# Altium schematic sheet Lattice_ECP5.SchDoc: <title>
size C; Organization: Custom Embedded Solutions, LLC.; Address1: 130 Oakland Trace; Address2: Madison, AL 35758; DocumentNumber: <doc_num>; Revision: <Rev>; SheetNumber: 2; SheetTotal: 8; PageTitle: FPGA I/O
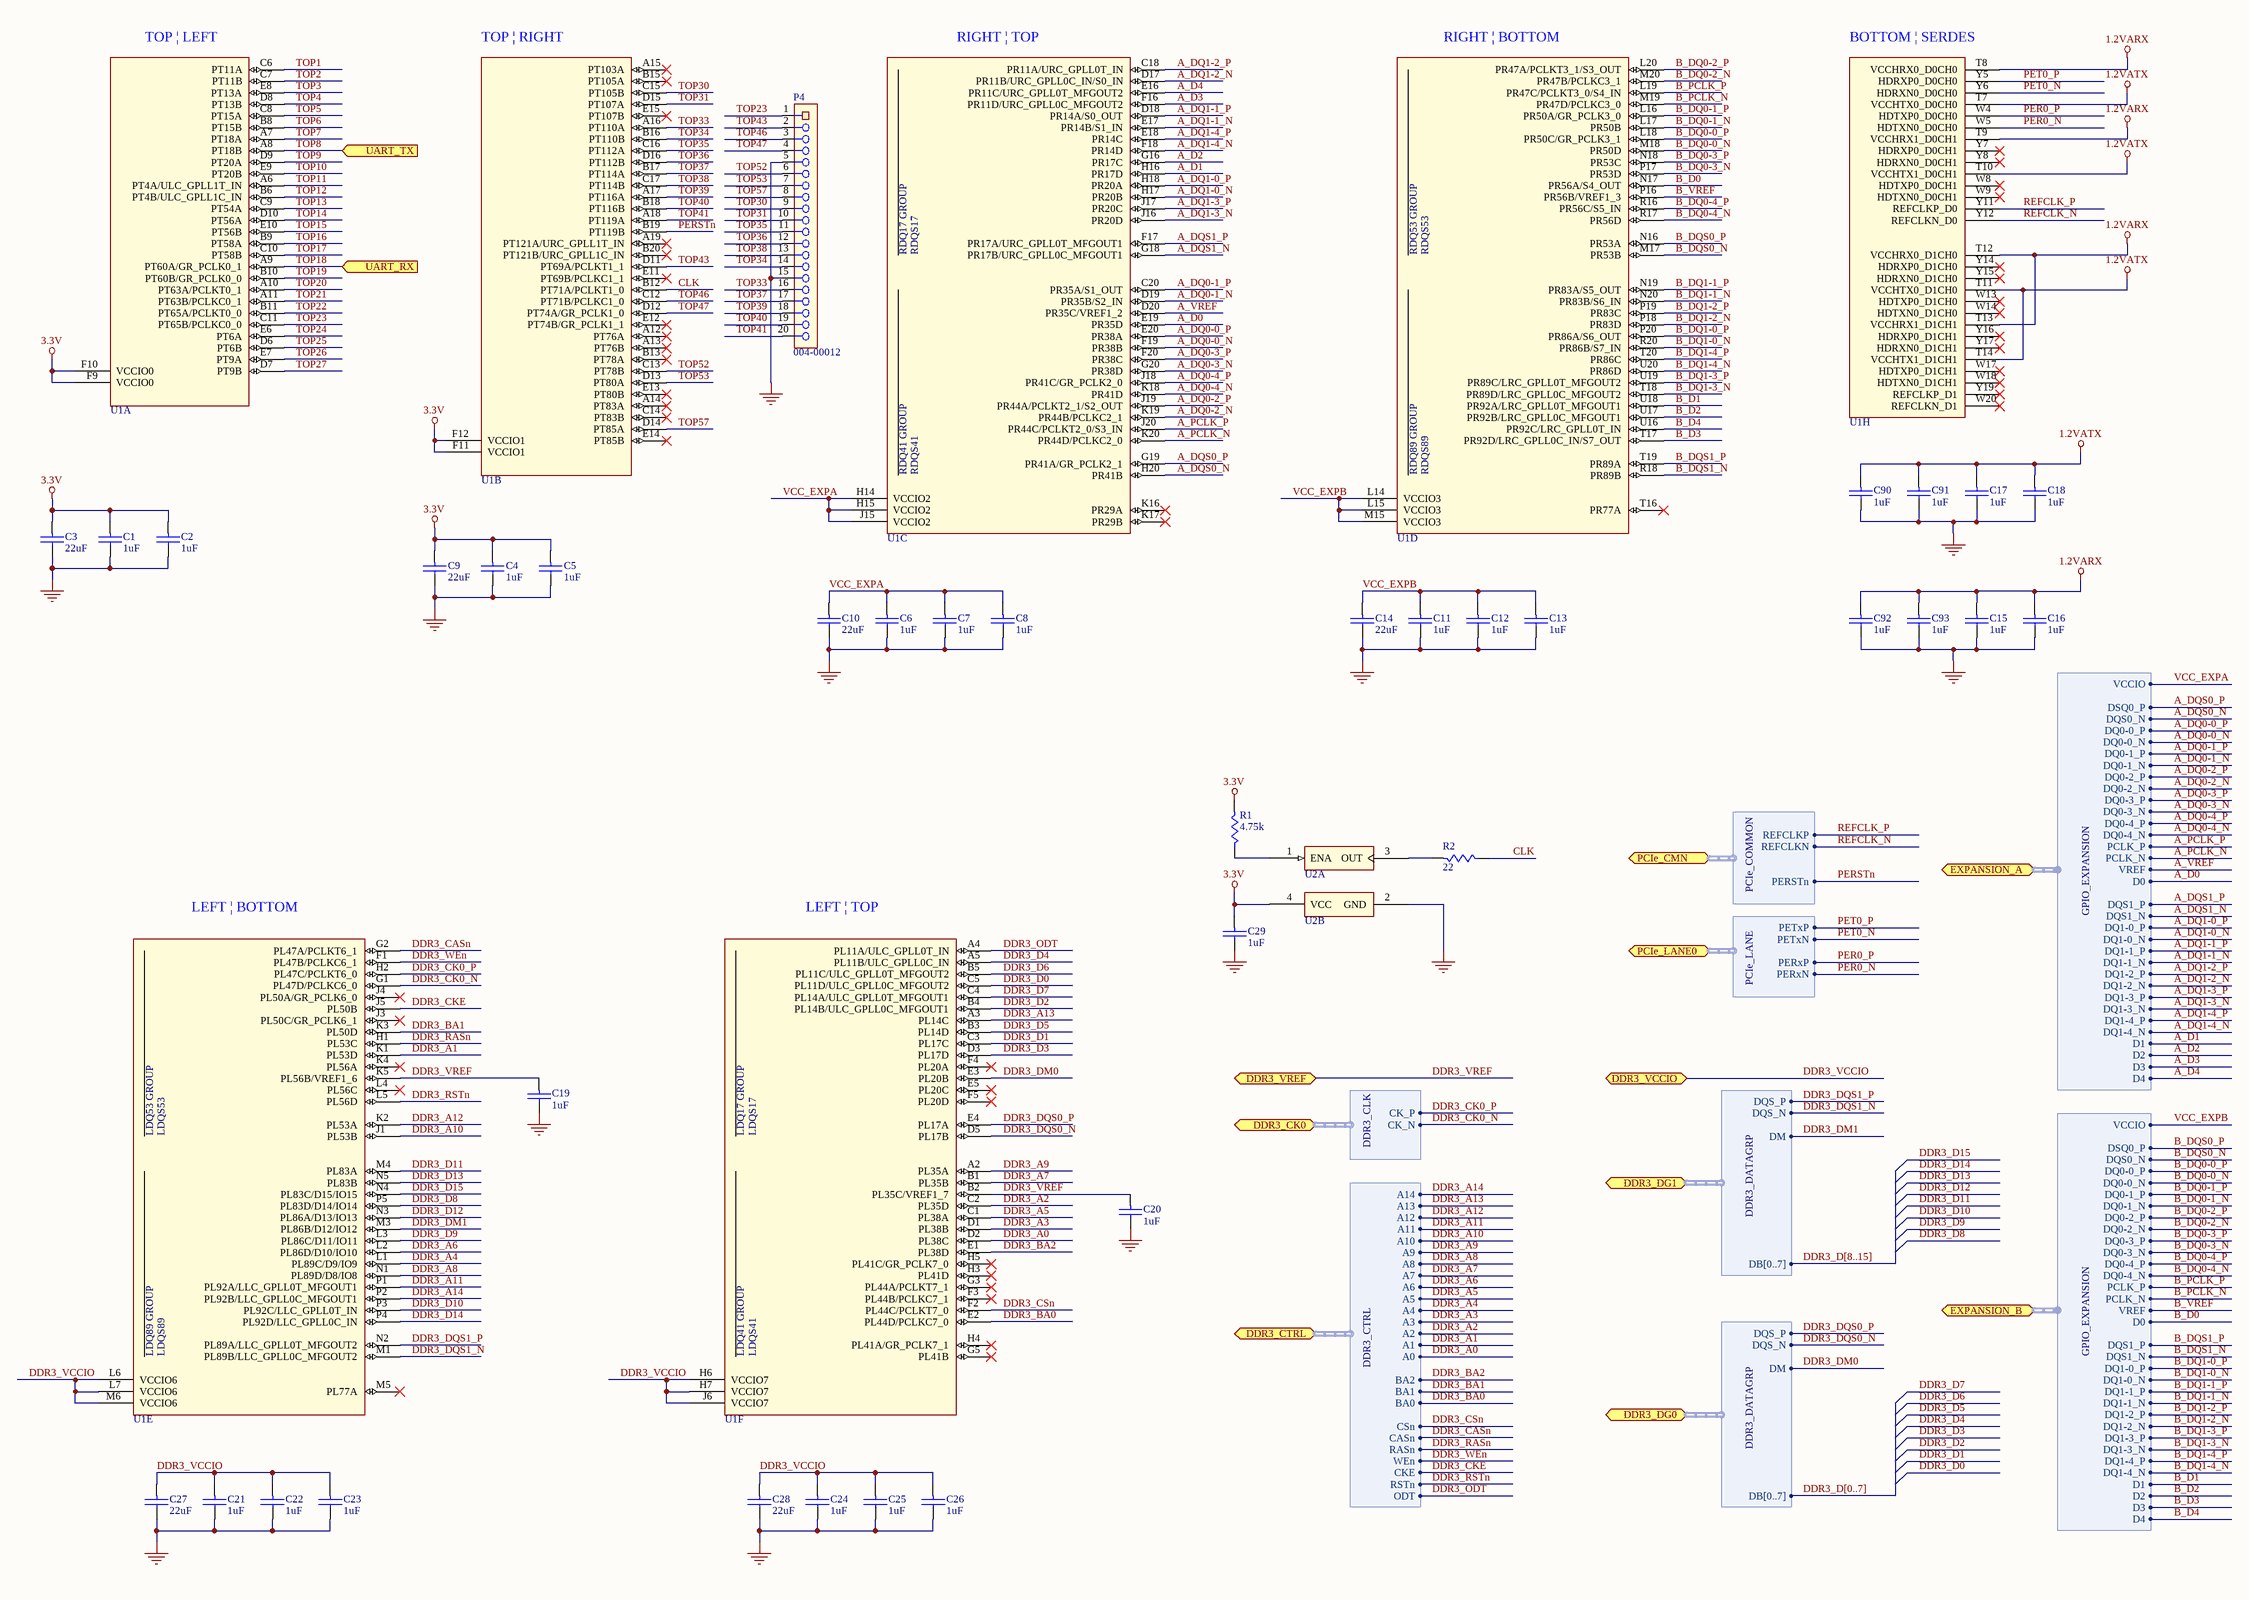
[diagram p0: Lattice_ECP5.SchDoc]

## Parts
C1  1uF  [005-00008]
C2  1uF  [005-00008]
C3  22uF  [005-00003]
C4  1uF  [005-00008]
C5  1uF  [005-00008]
C6  1uF  [005-00008]
C7  1uF  [005-00008]
C8  1uF  [005-00008]
C9  22uF  [005-00003]
C10  22uF  [005-00003]
C11  1uF  [005-00008]
C12  1uF  [005-00008]
C13  1uF  [005-00008]
C14  22uF  [005-00003]
C15  1uF  [005-00008]
C16  1uF  [005-00008]
C17  1uF  [005-00008]
C18  1uF  [005-00008]
C19  1uF  [005-00008]
C20  1uF  [005-00008]
C21  1uF  [005-00008]
C22  1uF  [005-00008]
C23  1uF  [005-00008]
C24  1uF  [005-00008]
C25  1uF  [005-00008]
C26  1uF  [005-00008]
C27  22uF  [005-00003]
C28  22uF  [005-00003]
C29  1uF  [005-00008]
C90  1uF  [005-00008]
C91  1uF  [005-00008]
C92  1uF  [005-00008]
C93  1uF  [005-00008]
P4  004-00012  [005-00014]
R1  4.75k  [005-00009]
R2  22  [005-00009]
U1  004-00015  [005-00017]  (value not drawn)  (parts A,B,C,D,E,F,H of 10)
U2  004-00014  [005-00016]  (value not drawn)  (parts A,B of 2)

## Ports
DDR3_CK0 (harness DDR3_CLK), DDR3_CTRL (harness DDR3_CTRL), DDR3_DG0 (harness DDR3_DATAGRP), DDR3_DG1 (harness DDR3_DATAGRP), DDR3_VCCIO, DDR3_VREF, EXPANSION_A (harness GPIO_EXPANSION), EXPANSION_B (harness GPIO_EXPANSION), PCIe_CMN (harness PCIe_COMMON), PCIe_LANE0 (harness PCIe_LANE), UART_RX (in), UART_TX (in)

## Harnesses
PCIe_COMMON: PERSTn, REFCLKP, REFCLKN
PCIe_LANE: PETxP, PETxN, PERxP, PERxN
GPIO_EXPANSION: DSQ0_P, DQS0_N, DQ0-0_P, DQ0-0_N, DQ0-1_P, DQ0-1_N, DQ0-2_P, DQ0-2_N, DQ0-3_P, DQ0-3_N, DQ0-4_P, DQ0-4_N, PCLK_P, PCLK_N, VREF, D0, DQS1_P, DQS1_N, DQ1-0_P, DQ1-0_N, DQ1-1_P, DQ1-1_N, DQ1-2_P, DQ1-2_N, DQ1-3_P, DQ1-3_N, DQ1-4_P, DQ1-4_N, D1, D2, D3, D4, VCCIO
DDR3_CLK: CK_P, CK_N
DDR3_CTRL: A14, A13, A12, A11, A10, A9, A8, A7, A6, A5, A4, A3, A2, A1, A0, BA2, BA1, BA0, CSn, RASn, CASn, WEn, CKE, RSTn, ODT
DDR3_DATAGRP: DQS_P, DQS_N, DM, DB[0..7]

## Nets
1.2VARX: C15.1 C16.1 C92.1 C93.1 U1.T8(VCCHRX0_D0CH0) U1.T9(VCCHRX1_D0CH1) U1.T12(VCCHRX0_D1CH0) U1.T13(VCCHRX1_D1CH1)
1.2VATX: C17.1 C18.1 C90.1 C91.1 U1.T7(VCCHTX0_D0CH0) U1.T10(VCCHTX1_D0CH1) U1.T11(VCCHTX0_D1CH0) U1.T14(VCCHTX1_D1CH1)
3.3V: C1.1 C2.1 C3.1 C4.1 C5.1 C9.1 C29.1 R1.1 U1.F9(VCCIO0) U1.F10(VCCIO0) U1.F11(VCCIO1) U1.F12(VCCIO1) U2.4(VCC)
GND: C1.2 C2.2 C3.2 C4.2 C5.2 C6.2 C7.2 C8.2 C9.2 C10.2 C11.2 C12.2 C13.2 C14.2 C15.2 C16.2 C17.2 C18.2 C19.2 C20.2 C21.2 C22.2 C23.2 C24.2 C25.2 C26.2 C27.2 C28.2 C29.2 C90.2 C91.2 C92.2 C93.2 P4.5 P4.15 U2.2(GND)
A_D0: U1.E19(PR35D) ; port EXPANSION_A.D0
A_D1: U1.H16(PR17D) ; port EXPANSION_A.D1
A_D2: U1.G16(PR17C) ; port EXPANSION_A.D2
A_D3: U1.F16(PR11D/URC_GPLL0C_MFGOUT2) ; port EXPANSION_A.D3
A_D4: U1.E16(PR11C/URC_GPLL0T_MFGOUT2) ; port EXPANSION_A.D4
A_DQ0-0_N: U1.F19(PR38B) ; port EXPANSION_A.DQ0-0_N
A_DQ0-0_P: U1.E20(PR38A) ; port EXPANSION_A.DQ0-0_P
A_DQ0-1_N: U1.D19(PR35B/S2_IN) ; port EXPANSION_A.DQ0-1_N
A_DQ0-1_P: U1.C20(PR35A/S1_OUT) ; port EXPANSION_A.DQ0-1_P
A_DQ0-2_N: U1.K19(PR44B/PCLKC2_1) ; port EXPANSION_A.DQ0-2_N
A_DQ0-2_P: U1.J19(PR44A/PCLKT2_1/S2_OUT) ; port EXPANSION_A.DQ0-2_P
A_DQ0-3_N: U1.G20(PR38D) ; port EXPANSION_A.DQ0-3_N
A_DQ0-3_P: U1.F20(PR38C) ; port EXPANSION_A.DQ0-3_P
A_DQ0-4_N: U1.K18(PR41D) ; port EXPANSION_A.DQ0-4_N
A_DQ0-4_P: U1.J18(PR41C/GR_PCLK2_0) ; port EXPANSION_A.DQ0-4_P
A_DQ1-0_N: U1.H17(PR20B) ; port EXPANSION_A.DQ1-0_N
A_DQ1-0_P: U1.H18(PR20A) ; port EXPANSION_A.DQ1-0_P
A_DQ1-1_N: U1.E17(PR14B/S1_IN) ; port EXPANSION_A.DQ1-1_N
A_DQ1-1_P: U1.D18(PR14A/S0_OUT) ; port EXPANSION_A.DQ1-1_P
A_DQ1-2_N: U1.D17(PR11B/URC_GPLL0C_IN/S0_IN) ; port EXPANSION_A.DQ1-2_N
A_DQ1-2_P: U1.C18(PR11A/URC_GPLL0T_IN) ; port EXPANSION_A.DQ1-2_P
A_DQ1-3_N: U1.J16(PR20D) ; port EXPANSION_A.DQ1-3_N
A_DQ1-3_P: U1.J17(PR20C) ; port EXPANSION_A.DQ1-3_P
A_DQ1-4_N: U1.F18(PR14D) ; port EXPANSION_A.DQ1-4_N
A_DQ1-4_P: U1.E18(PR14C) ; port EXPANSION_A.DQ1-4_P
A_DQS0_N: U1.H20(PR41B) ; port EXPANSION_A.DQS0_N
A_DQS0_P: U1.G19(PR41A/GR_PCLK2_1) ; port EXPANSION_A.DSQ0_P
A_DQS1_N: U1.G18(PR17B/URC_GPLL0C_MFGOUT1) ; port EXPANSION_A.DQS1_N
A_DQS1_P: U1.F17(PR17A/URC_GPLL0T_MFGOUT1) ; port EXPANSION_A.DQS1_P
A_PCLK_N: U1.K20(PR44D/PCLKC2_0) ; port EXPANSION_A.PCLK_N
A_PCLK_P: U1.J20(PR44C/PCLKT2_0/S3_IN) ; port EXPANSION_A.PCLK_P
A_VREF: U1.D20(PR35C/VREF1_2) ; port EXPANSION_A.VREF
B_D0: U1.N17(PR56A/S4_OUT) ; port EXPANSION_B.D0
B_D1: U1.U18(PR92A/LRC_GPLL0T_MFGOUT1) ; port EXPANSION_B.D1
B_D2: U1.U17(PR92B/LRC_GPLL0C_MFGOUT1) ; port EXPANSION_B.D2
B_D3: U1.T17(PR92D/LRC_GPLL0C_IN/S7_OUT) ; port EXPANSION_B.D3
B_D4: U1.U16(PR92C/LRC_GPLL0T_IN) ; port EXPANSION_B.D4
B_DQ0-0_N: U1.M18(PR50D) ; port EXPANSION_B.DQ0-0_N
B_DQ0-0_P: U1.L18(PR50C/GR_PCLK3_1) ; port EXPANSION_B.DQ0-0_P
B_DQ0-1_N: U1.L17(PR50B) ; port EXPANSION_B.DQ0-1_N
B_DQ0-1_P: U1.L16(PR50A/GR_PCLK3_0) ; port EXPANSION_B.DQ0-1_P
B_DQ0-2_N: U1.M20(PR47B/PCLKC3_1) ; port EXPANSION_B.DQ0-2_N
B_DQ0-2_P: U1.L20(PR47A/PCLKT3_1/S3_OUT) ; port EXPANSION_B.DQ0-2_P
B_DQ0-3_N: U1.P17(PR53D) ; port EXPANSION_B.DQ0-3_N
B_DQ0-3_P: U1.N18(PR53C) ; port EXPANSION_B.DQ0-3_P
B_DQ0-4_N: U1.R17(PR56D) ; port EXPANSION_B.DQ0-4_N
B_DQ0-4_P: U1.R16(PR56C/S5_IN) ; port EXPANSION_B.DQ0-4_P
B_DQ1-0_N: U1.R20(PR86B/S7_IN) ; port EXPANSION_B.DQ1-0_N
B_DQ1-0_P: U1.P20(PR86A/S6_OUT) ; port EXPANSION_B.DQ1-0_P
B_DQ1-1_N: U1.N20(PR83B/S6_IN) ; port EXPANSION_B.DQ1-1_N
B_DQ1-1_P: U1.N19(PR83A/S5_OUT) ; port EXPANSION_B.DQ1-1_P
B_DQ1-2_N: U1.P18(PR83D) ; port EXPANSION_B.DQ1-2_N
B_DQ1-2_P: U1.P19(PR83C) ; port EXPANSION_B.DQ1-2_P
B_DQ1-3_N: U1.T18(PR89D/LRC_GPLL0C_MFGOUT2) ; port EXPANSION_B.DQ1-3_N
B_DQ1-3_P: U1.U19(PR89C/LRC_GPLL0T_MFGOUT2) ; port EXPANSION_B.DQ1-3_P
B_DQ1-4_N: U1.U20(PR86D) ; port EXPANSION_B.DQ1-4_N
B_DQ1-4_P: U1.T20(PR86C) ; port EXPANSION_B.DQ1-4_P
B_DQS0_N: U1.M17(PR53B) ; port EXPANSION_B.DQS0_N
B_DQS0_P: U1.N16(PR53A) ; port EXPANSION_B.DSQ0_P
B_DQS1_N: U1.R18(PR89B) ; port EXPANSION_B.DQS1_N
B_DQS1_P: U1.T19(PR89A) ; port EXPANSION_B.DQS1_P
B_PCLK_N: U1.M19(PR47D/PCLKC3_0) ; port EXPANSION_B.PCLK_N
B_PCLK_P: U1.L19(PR47C/PCLKT3_0/S4_IN) ; port EXPANSION_B.PCLK_P
B_VREF: U1.P16(PR56B/VREF1_3) ; port EXPANSION_B.VREF
CLK: R2.2 U1.B12(PT71A/PCLKT1_0)
DDR3_A0: U1.D2(PL38C) ; port DDR3_CTRL.A0
DDR3_A1: U1.K1(PL53D) ; port DDR3_CTRL.A1
DDR3_A2: U1.C2(PL35D) ; port DDR3_CTRL.A2
DDR3_A3: U1.D1(PL38B) ; port DDR3_CTRL.A3
DDR3_A4: U1.L1(PL89C/D9/IO9) ; port DDR3_CTRL.A4
DDR3_A5: U1.C1(PL38A) ; port DDR3_CTRL.A5
DDR3_A6: U1.L2(PL86D/D10/IO10) ; port DDR3_CTRL.A6
DDR3_A7: U1.B1(PL35B) ; port DDR3_CTRL.A7
DDR3_A8: U1.N1(PL89D/D8/IO8) ; port DDR3_CTRL.A8
DDR3_A9: U1.A2(PL35A) ; port DDR3_CTRL.A9
DDR3_A10: U1.J1(PL53B) ; port DDR3_CTRL.A10
DDR3_A11: U1.P1(PL92A/LLC_GPLL0T_MFGOUT1) ; port DDR3_CTRL.A11
DDR3_A12: U1.K2(PL53A) ; port DDR3_CTRL.A12
DDR3_A13: U1.A3(PL14C) ; port DDR3_CTRL.A13
DDR3_A14: U1.P2(PL92B/LLC_GPLL0C_MFGOUT1) ; port DDR3_CTRL.A14
DDR3_BA0: U1.E2(PL44D/PCLKC7_0) ; port DDR3_CTRL.BA0
DDR3_BA1: U1.K3(PL50D) ; port DDR3_CTRL.BA1
DDR3_BA2: U1.E1(PL38D) ; port DDR3_CTRL.BA2
DDR3_CASn: U1.G2(PL47A/PCLKT6_1) ; port DDR3_CTRL.CASn
DDR3_CK0_N: U1.G1(PL47D/PCLKC6_0) ; port DDR3_CK0.CK_N
DDR3_CK0_P: U1.H2(PL47C/PCLKT6_0) ; port DDR3_CK0.CK_P
DDR3_CKE: U1.J5(PL50B) ; port DDR3_CTRL.CKE
DDR3_CSn: U1.F2(PL44C/PCLKT7_0) ; port DDR3_CTRL.CSn
DDR3_D0: U1.C5(PL11D/ULC_GPLL0C_MFGOUT2)
DDR3_D1: U1.C3(PL17C)
DDR3_D2: U1.B4(PL14B/ULC_GPLL0C_MFGOUT1)
DDR3_D3: U1.D3(PL17D)
DDR3_D4: U1.A5(PL11B/ULC_GPLL0C_IN)
DDR3_D5: U1.B3(PL14D)
DDR3_D6: U1.B5(PL11C/ULC_GPLL0T_MFGOUT2)
DDR3_D7: U1.C4(PL14A/ULC_GPLL0T_MFGOUT1)
DDR3_D8: U1.P5(PL83D/D14/IO14)
DDR3_D9: U1.L3(PL86C/D11/IO11)
DDR3_D10: U1.P3(PL92C/LLC_GPLL0T_IN)
DDR3_D11: U1.M4(PL83A)
DDR3_D12: U1.N3(PL86A/D13/IO13)
DDR3_D13: U1.N5(PL83B)
DDR3_D14: U1.P4(PL92D/LLC_GPLL0C_IN)
DDR3_D15: U1.N4(PL83C/D15/IO15)
DDR3_DM0: U1.E3(PL20B) ; port DDR3_DG0.DM
DDR3_DM1: U1.M3(PL86B/D12/IO12) ; port DDR3_DG1.DM
DDR3_DQS0_N: U1.D5(PL17B) ; port DDR3_DG0.DQS_N
DDR3_DQS0_P: U1.E4(PL17A) ; port DDR3_DG0.DQS_P
DDR3_DQS1_N: U1.M1(PL89B/LLC_GPLL0C_MFGOUT2) ; port DDR3_DG1.DQS_N
DDR3_DQS1_P: U1.N2(PL89A/LLC_GPLL0T_MFGOUT2) ; port DDR3_DG1.DQS_P
DDR3_ODT: U1.A4(PL11A/ULC_GPLL0T_IN) ; port DDR3_CTRL.ODT
DDR3_RASn: U1.H1(PL53C) ; port DDR3_CTRL.RASn
DDR3_RSTn: U1.L5(PL56D) ; port DDR3_CTRL.RSTn
DDR3_VCCIO: C21.1 C22.1 C23.1 C24.1 C25.1 C26.1 C27.1 C28.1 U1.H6(VCCIO7) U1.H7(VCCIO7) U1.J6(VCCIO7) U1.L6(VCCIO6) U1.L7(VCCIO6) U1.M6(VCCIO6) ; port DDR3_VCCIO
DDR3_VREF: C19.1 C20.1 U1.B2(PL35C/VREF1_7) U1.K5(PL56B/VREF1_6) ; port DDR3_VREF
DDR3_WEn: U1.F1(PL47B/PCLKC6_1) ; port DDR3_CTRL.WEn
PER0_N: U1.W5(HDTXN0_D0CH0) ; port PCIe_LANE0.PERxN
PER0_P: U1.W4(HDTXP0_D0CH0) ; port PCIe_LANE0.PERxP
PERSTn: U1.B19(PT119B) ; port PCIe_CMN.PERSTn
PET0_N: U1.Y6(HDRXN0_D0CH0) ; port PCIe_LANE0.PETxN
PET0_P: U1.Y5(HDRXP0_D0CH0) ; port PCIe_LANE0.PETxP
REFCLK_N: U1.Y12(REFCLKN_D0) ; port PCIe_CMN.REFCLKN
REFCLK_P: U1.Y11(REFCLKP_D0) ; port PCIe_CMN.REFCLKP
TOP1: U1.C6(PT11A)
TOP2: U1.C7(PT11B)
TOP3: U1.E8(PT13A)
TOP4: U1.D8(PT13B)
TOP5: U1.C8(PT15A)
TOP6: U1.B8(PT15B)
TOP7: U1.A7(PT18A)
TOP8: U1.A8(PT18B) ; port UART_TX
TOP9: U1.D9(PT20A)
TOP10: U1.E9(PT20B)
TOP11: U1.A6(PT4A/ULC_GPLL1T_IN)
TOP12: U1.B6(PT4B/ULC_GPLL1C_IN)
TOP13: U1.C9(PT54A)
TOP14: U1.D10(PT56A)
TOP15: U1.E10(PT56B)
TOP16: U1.B9(PT58A)
TOP17: U1.C10(PT58B)
TOP18: U1.A9(PT60A/GR_PCLK0_1) ; port UART_RX
TOP19: U1.B10(PT60B/GR_PCLK0_0)
TOP20: U1.A10(PT63A/PCLKT0_1)
TOP21: U1.A11(PT63B/PCLKC0_1)
TOP22: U1.B11(PT65A/PCLKT0_0)
TOP23: P4.1 U1.C11(PT65B/PCLKC0_0)
TOP24: U1.E6(PT6A)
TOP25: U1.D6(PT6B)
TOP26: U1.E7(PT9A)
TOP27: U1.D7(PT9B)
TOP30: P4.9 U1.C15(PT105B)
TOP31: P4.10 U1.D15(PT107A)
TOP33: P4.16 U1.A16(PT110A)
TOP34: P4.14 U1.B16(PT110B)
TOP35: P4.11 U1.C16(PT112A)
TOP36: P4.12 U1.D16(PT112B)
TOP37: P4.17 U1.B17(PT114A)
TOP38: P4.13 U1.C17(PT114B)
TOP39: P4.18 U1.A17(PT116A)
TOP40: P4.19 U1.B18(PT116B)
TOP41: P4.20 U1.A18(PT119A)
TOP43: P4.2 U1.D11(PT69A/PCLKT1_1)
TOP46: P4.3 U1.C12(PT71B/PCLKC1_0)
TOP47: P4.4 U1.D12(PT74A/GR_PCLK1_0)
TOP52: P4.6 U1.C13(PT78B)
TOP53: P4.7 U1.D13(PT80A)
TOP57: P4.8 U1.D14(PT85A)
VCC_EXPA: C6.1 C7.1 C8.1 C10.1 U1.H14(VCCIO2) U1.H15(VCCIO2) U1.J15(VCCIO2) ; port EXPANSION_A.VCCIO
VCC_EXPB: C11.1 C12.1 C13.1 C14.1 U1.L14(VCCIO3) U1.L15(VCCIO3) U1.M15(VCCIO3) ; port EXPANSION_B.VCCIO
NetR1_2: R1.2 U2.1(ENA)
NetR2_1: R2.1 U2.3(OUT)

Not connected (* = marked no-connect by the designer): U1 A12(PT76A)* A13(PT76B)* A14(PT83A)* A15(PT103A)* A19(PT121A/URC_GPLL1T_IN)* B13(PT78A)* B15(PT105A)* B20(PT121B/URC_GPLL1C_IN)* C14(PT83B)* E5(PL20C)* E11(PT69B/PCLKC1_1)* E12(PT74B/GR_PCLK1_1)* E13(PT80B)* E14(PT85B)* E15(PT107B)* F3(PL44B/PCLKC7_1)* F4(PL20A)* F5(PL20D)* G3(PL44A/PCLKT7_1)* G5(PL41B)* H3(PL41D)* H4(PL41A/GR_PCLK7_1)* H5(PL41C/GR_PCLK7_0)* J3(PL50C/GR_PCLK6_1)* J4(PL50A/GR_PCLK6_0)* K4(PL56A)* K16(PR29A)* K17(PR29B)* L4(PL56C)* M5(PL77A)* T16(PR77A)* W8(HDTXP0_D0CH1)* W9(HDTXN0_D0CH1)* W13(HDTXP0_D1CH0)* W14(HDTXN0_D1CH0)* W17(HDTXP0_D1CH1)* W18(HDTXN0_D1CH1)* W20(REFCLKN_D1)* Y7(HDRXP0_D0CH1)* Y8(HDRXN0_D0CH1)* Y14(HDRXP0_D1CH0)* Y15(HDRXN0_D1CH0)* Y16(HDRXP0_D1CH1)* Y17(HDRXN0_D1CH1)* Y19(REFCLKP_D1)*

## Buses and harness runs
bus DDR3_D[0..7]
bus DDR3_D[8..15]

## Notes on the sheet
- (near U1) TOP | LEFT
- (near U1) TOP | RIGHT
- (near U1) RIGHT | TOP
- (near U1) RIGHT | BOTTOM
- (near U1) BOTTOM | SERDES
- (near U1) LEFT | BOTTOM
- (near U1) LEFT | TOP
- Copyright (c)
- Page Title
- Design Title
- Creative Commons License, http://creativecommons.org/licenses/by/4.0/legalcode
  This PCB design by Custom Embedded Solutions, LLC. is licensed under a Creative Commons Attribution 4.0 International License.
- Size:
- Date:
- File:
- C
- Document Number:
- Time:
- Sheet
- Rev:
- of
- (in symbol 012-00019, part C) RDQ17 GROUP; RDQS17; RDQ41 GROUP; RDQS41
- (in symbol 012-00019, part D) RDQ53 GROUP; RDQS53; RDQ89 GROUP; RDQS89
- (in symbol 012-00019, part E) LDQ53 GROUP; LDQS53; LDQ89 GROUP; LDQS89
- (in symbol 012-00019, part F) LDQ17 GROUP; LDQS17; LDQ41 GROUP; LDQS41

## Library data of the parts
C1 C2 C4-C8 C11-C13 C15-C26 C90-C93 = 011-00017: CAP CER 1UF 6.3V 10% X5R 0402; Manufacturer1 Part Number: CL05A105KQ5NNNC; Manufacturer1: Samsung; Types: Y1; Type: Ceramic; Part Number: 011-00017; Substrate: X5R; Voltage: 6.3V; Value: 1uF; Package: 1005, EIA 0402, Chip Capacitor, 2-Leads, Body 1.00x0.50mm, IPC High Density
C3 C9 C10 C14 C27 C28 = 011-00004: CAP CER 22UF 6.3V X5R 20% 0805; Manufacturer1 Part Number: C2012X5R0J226M/1.25; Manufacturer1: TDK; Manufacturer2 Part Number: CL21A226KQQNNNF; Manufacturer3 Part Number: 08056D226MAT2A; 3rd Party: {Reference Design}; Type: Ceramic; Part Number: 011-00004; Voltage: 6.3V; Substrate: X5R; Manufacturer2: Samsung; Manufacturer3: AVX; Value: 22uF; Package: 2012, EIA 0805, Chip Capacitor, 2-Leads, Body 2.00x1.25mm, IPC High Density
C29 = 011-00010: Capacitor 1uF 10V Ceramic 10% 0402; Manufacturer1 Part Number: 0402ZD105KAT2A; Manufacturer1: AVX; 3rd Party: {Reference Design}; Types: Ratings; Part Number: 011-00010; Voltage: 10V; Type: Ceramic; Value: 1uF; Package: 1005, EIA 0402, Chip Capacitor, 2-Leads, Body 1.00x0.50mm, IPC High Density
P4 = 017-00011: CONN RCPT 2x10; Manufacturer1 Part Number: 54102-S05-10LF; Manufacturer1: FCI; Manufacturer2 Part Number: TSHS-110-D-06-A-GT-LF; Circuits: 20; Part Number: 017-00011; Manufacturer2: Major League; Manufacturer3: Molex; Manufacturer3 Part Number: 10-89-7202; Type: Receptacle; Package: 2x10 100mil header
R1 = 009-00001: RES 4.75K OHM 1/16W 1% 0402 SMD; Manufacturer1 Part Number: RMCF0402FT4K75; Manufacturer1: Stackpole Electronics; 3rd Party: {Reference Design}; Tolerance: 0.01; Types: Metal Film; Part Number: 009-00001; Power: 1/16W; Value: 4.75k; Package: 1005, EIA 0402, Chip Resistor, 2-Leads, Body 1.00x0.50mm, IPC High Density
R2 = 009-00020: RES 22 OHM 1/16W 5% 0402; Manufacturer1 Part Number: RMCF0402JT22R0; Manufacturer1: Stackpole Electronics; Tolerance: 0.05; Part Number: 009-00020; Power: 1/16W; Value: 22; Package: 1005, EIA 0402, Chip Resistor, 2-Leads, Body 1.00x0.50mm, IPC High Density
U1 = 012-00019: IC FPGA 4/203 I/O 381caBGA; Manufacturer1: Lattice; Manufacturer1 Part Number: LFE5UM-45F-6BG381C; SWAP_INFO: (S1+S2+S3+S4+S5+S6+S7+S8+S9+S10); SPLIT_INST: TRUE; Part Number: 012-00019; Type: Embedded (uP/PLD); Package: CABGA 381 8x14x1.2mm 17.0x17.0mm 0.8mm pitch
U2 = 015-00005: OSC MEMS 50.000 MHZ SMD; Manufacturer1 Part Number: ASEMB-50.000MHZ-LC-T; Manufacturer1: Abracon; Stability: 3.3V – 1.8V; Capacitance: 50ppm; Tolerance: Tri-state; Part Number: 015-00005; Value: 50.000MHz; Package: 3225, Osc, 4-Leads, Body 3.20x2.50mm